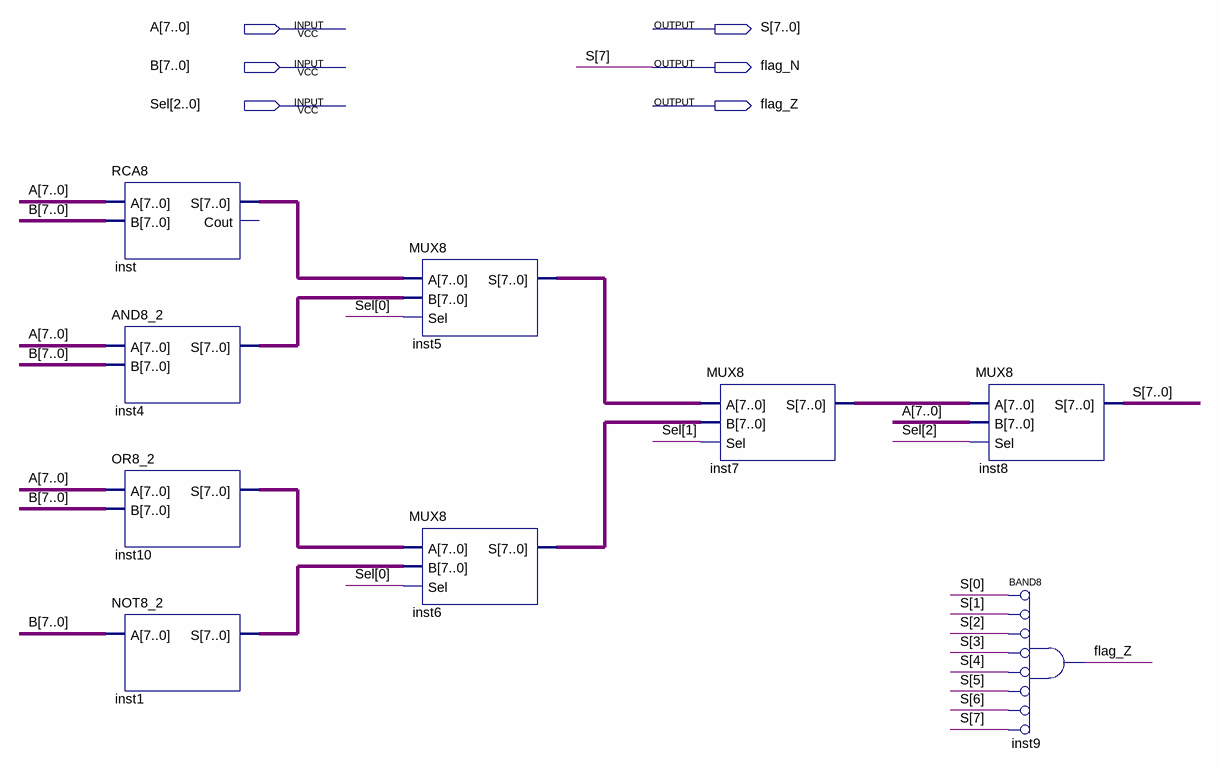
[diagram p0: schematic sheet]
// Quartus schematic ULA.bdf as structural Verilog: 9 symbols, 6 pins
module ULA (
  input  [7:0] A,
  input  [7:0] B,
  input  [2:0] Sel,
  output [7:0] S,
  output flag_N,
  output flag_Z
);

  wire [7:0] inst1_s, inst4_s, inst5_s, inst6_s, inst7_s, inst10_s, inst_s;

  RCA8 inst (.A(A), .B(B), .S(inst_s));  // open: Cout
  AND8_2 inst4 (.A(A), .B(B), .S(inst4_s));
  OR8_2 inst10 (.A(A), .B(B), .S(inst10_s));
  NOT8_2 inst1 (.A(B), .S(inst1_s));
  MUX8 inst5 (.A(inst_s), .B(inst4_s), .Sel(Sel[0]), .S(inst5_s));
  MUX8 inst6 (.A(inst10_s), .B(inst1_s), .Sel(Sel[0]), .S(inst6_s));
  MUX8 inst7 (.A(inst5_s), .B(inst6_s), .Sel(Sel[1]), .S(inst7_s));
  MUX8 inst8 (.A(inst7_s), .B(A), .Sel(Sel[2]), .S({flag_N, S[6:0]}));
  and inst9 (flag_Z, ~S[0], ~S[1], ~S[2], ~S[3], ~S[4], ~S[5], ~S[6], ~flag_N);  // BAND8

  assign S[7] = flag_N;
endmodule
